# EAGLE design beacon (EAGLE 6.4)
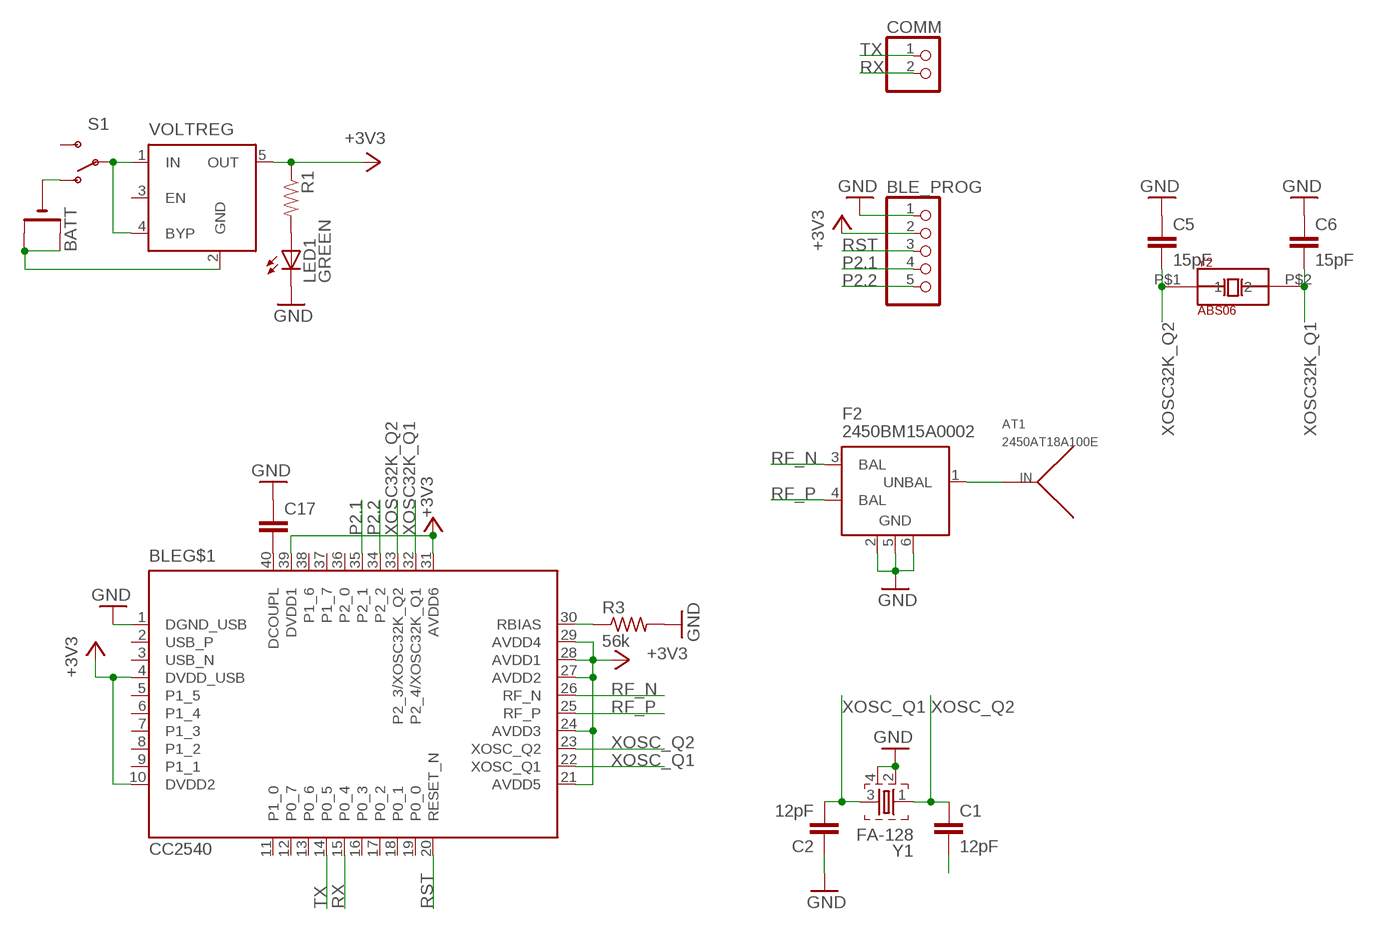
[diagram p0: schematic, sheet 1]

## Parts
AT1  2450AT18A100E  [2450AT18A100E]
BATT  CR2032SMT  [CR2032-SMD]
BLE  CC2540  [QFN40-6X6]
BLE_PROG  PINHD-1X5  [1X05]
C1  12pF  C-EUC0402  [C0402]
C2  12pF  C-EUC0402  [C0402]
C5  15pF  C-EUC0402  [C0402]
C6  15pF  C-EUC0402  [C0402]
C17  C-EUC0402  [C0402]
COMM  PINHD-1X2  [1X02]
F2  2450BM15A0002  [2450BM15A0002]
LED1  GREEN  LED-GREEN0603  [LED-0603]
R1  RESISTOR0402-RES  [0402-RES]
R3  56k  R-US_R0402  [R0402]
S1  SWITCH-SPDT-SMD-A  [SWITCH-SPST-SMD-A]
VOLTREG  MIC5219XX  [SOT23-5]
Y1  FA-128  [FA-128]
Y2  ABS06  [SMD]

## Nets
+3V3: BLE.4(DVDD_USB) BLE.10(DVDD2) BLE.21(AVDD5) BLE.24(AVDD3) BLE.27(AVDD2) BLE.28(AVDD1) BLE.29(AVDD4) BLE.31(AVDD6) BLE.39(DVDD1) BLE_PROG.2 R1.1 VOLTREG.5(OUT)
GND: BLE.1(DGND_USB) BLE_PROG.1 C2.1 C5.1 C6.1 C17.1 F2.2(GND) F2.5(GND) F2.6(GND) LED1.C R3.2 Y1.2 Y1.4
N$1: BLE.40(DCOUPL) C17.2
N$2: BLE.30(RBIAS) R3.1
N$3: LED1.A R1.2
N$4: AT1.P$1(IN) F2.1(UNBAL)
N$5: BATT.- S1.1(O)
N$6: S1.2(P) VOLTREG.1(IN) VOLTREG.4(BYP)
N$7: BATT.+$1(+) BATT.+$2(+1) VOLTREG.2(GND)
N$8: C1.2
P2.1: BLE.35(P2_1) BLE_PROG.4
P2.2: BLE.34(P2_2) BLE_PROG.5
RF_N: BLE.26(RF_N) F2.3(BAL)
RF_P: BLE.25(RF_P) F2.4(BAL)
RST: BLE.20(RESET_N) BLE_PROG.3
RX: BLE.15(P0_4) COMM.2
TX: BLE.14(P0_5) COMM.1
XOSC32K_Q1: BLE.32(P2_4/XOSC32K_Q1) C6.2 Y2.P$2
XOSC32K_Q2: BLE.33(P2_3/XOSC32K_Q2) C5.2 Y2.P$1
XOSC_Q1: BLE.22(XOSC_Q1) C2.2 Y1.3
XOSC_Q2: BLE.23(XOSC_Q2) C1.1 Y1.1
Unconnected: BLE.2(USB_P) BLE.3(USB_N) BLE.5(P1_5) BLE.6(P1_4) BLE.7(P1_3) BLE.8(P1_2) BLE.9(P1_1) BLE.11(P1_0) BLE.12(P0_7) BLE.13(P0_6) BLE.16(P0_3) BLE.17(P0_2) BLE.18(P0_1) BLE.19(P0_0) BLE.36(P2_0) BLE.37(P1_7) BLE.38(P1_6) BLE.EXP@1(EXP:EXP16) BLE.EXP@2(EXP:EXP16) BLE.EXP@3(EXP:EXP16) BLE.EXP@4(EXP:EXP16) BLE.EXP@5(EXP:EXP16) BLE.EXP@6(EXP:EXP16) BLE.EXP@7(EXP:EXP16) BLE.EXP@8(EXP:EXP16) BLE.EXP@9(EXP:EXP16) BLE.EXP@10(EXP:EXP16) BLE.EXP@11(EXP:EXP16) BLE.EXP@12(EXP:EXP16) BLE.EXP@13(EXP:EXP16) BLE.EXP@14(EXP:EXP16) BLE.EXP@15(EXP:EXP16) BLE.EXP@16(EXP:EXP16) S1.3(S) VOLTREG.3(EN)

## Library data of the parts
AT1 = ble-arduino:2450AT18A100E
BATT = adafruit:CR2032
BLE = texas:CC2540: 2.4-GHz Bluetooth® low energy System-on-Chip Auto generated by make-symbol-device-package-bsdl.ulp Rev. 39 Source: cc2540.txt
BLE_PROG = pinhead:PINHD-1X5: PIN HEADER
C1 C2 C5 C6 C17 = rcl:C-EU: CAPACITOR, European symbol
COMM = pinhead:PINHD-1X2: PIN HEADER
F2 = johanson-technology:2450BM15A0002: 2.45 GHz Impedance Matched Balun-Filter For TI CC253X/CC2540 Chipset family Data sheet <http://www.johansontechnology.com/images/stories/ip/baluns/balun_filter_combo_matched_2450bm15a0002_v8.pdf>
LED1 = SparkFun-LED:LED-GREEN: Various green LEDs 0603- DIO-00821 LARGE- DIO-00862 LILYPAD- DIO-09910; PROD_ID: DIO-00821
R1 = SparkFun-Passives:RESISTOR: Resistor Basic schematic elements and footprints for 0603, 1206, and PTH resistors.
R3 = resistor:R-US_: RESISTOR, American symbol
S1 = SparkFun-Electromechanical:SWITCH-SPDT: SPDT Switch Simple slide switch, Spark Fun Electronics SKU : COM-00102 DPDT SMT slide switch, AYZ0202, SWCH-08179
VOLTREG = v-reg-micrel:MIC5219XX: VOLTAGE REGULATOR; OC_FARNELL: unknown; OC_NEWARK: unknown
Y1 = crystal:FA-: MHz RANGE CRYSTAL UNIT Source: Epson Toyocom
Y2 = abracon:ABS06

## Net classes
0 default: width 0.203 mm

## Board
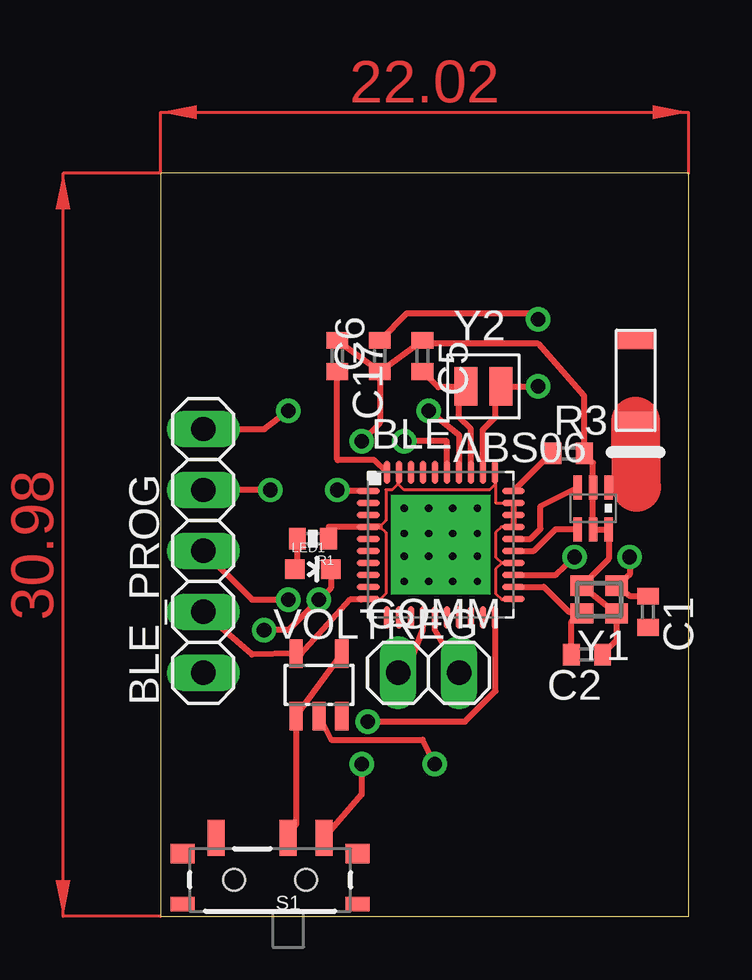
[diagram p1: board, top side]
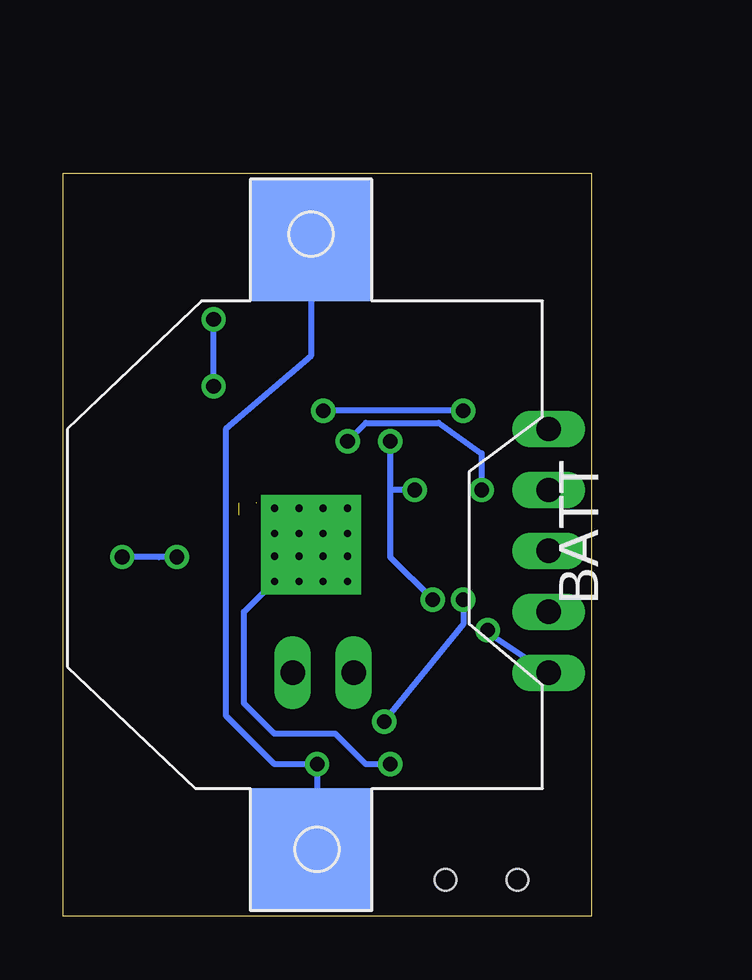
[diagram p2: board, bottom side, seen from below]

Size 22.02 x 30.98 mm. Coordinates in mm from the lower left corner, seen from the top.
Outline: 0,0 22.02,0 22.02,30.98 0,30.98 0,0
Copper layers (1*16): Top 0.035mm / dielectric 1.5mm / Bottom 0.035mm
Design rules "default": minimum track width 10mil, minimum drill 24mil, track to track 8mil, track to pad 8mil, pad to pad 8mil, via to via 8mil, smd to smd 8mil, copper to edge 40mil, drill to drill 8mil, minimum pad ring 10mil, minimum via ring 8mil, stop-mask expansion 4mil, vias tented up to drill 0mil, thermal gap 10mil

### Footprints (pad centres in the part's own frame; a part is rotated, then mirrored left to right if it is on the bottom)
2450AT18A100E = smd 0.8 x 1.6: P$1 1.7,0; P$2 -1.7,0
CR2032-SMD = smd 5.08 x 5.08: +$1 -12.7,0; +$2 12.7,0 | smd 4.064 x 4.064: - 0,0
QFN40-6X6 = smd 0.95 x 0.28: 1 -3.025,2.25; 2 -3.025,1.75; 3 -3.025,1.25; 4 -3.025,0.75; 5 -3.025,0.25; 6 -3.025,-0.25; 7 -3.025,-0.75; 8 -3.025,-1.25; 9 -3.025,-1.75; 10 -3.025,-2.25; 21 3.025,-2.25; 22 3.025,-1.75; 23 3.025,-1.25; 24 3.025,-0.75; 25 3.025,-0.25; 26 3.025,0.25; 27 3.025,0.75; 28 3.025,1.25; 29 3.025,1.75; 30 3.025,2.25 | smd 0.28 x 0.95: 11 -2.25,-3.025; 12 -1.75,-3.025; 13 -1.25,-3.025; 14 -0.75,-3.025; 15 -0.25,-3.025; 16 0.25,-3.025; 17 0.75,-3.025; 18 1.25,-3.025; 19 1.75,-3.025; 20 2.25,-3.025; 31 2.25,3.025; 32 1.75,3.025; 33 1.25,3.025; 34 0.75,3.025; 35 0.25,3.025; 36 -0.25,3.025; 37 -0.75,3.025; 38 -1.25,3.025; 39 -1.75,3.025; 40 -2.25,3.025 | drill 0.3 pad 1.1 square: EXP@1 -1.525,1.525; EXP@2 -0.5,1.525; EXP@3 0.5,1.525; EXP@4 1.525,1.525; EXP@5 -1.525,0.475; EXP@6 -0.5,0.475; EXP@7 0.5,0.475; EXP@8 1.525,0.475; EXP@9 -1.525,-0.475; EXP@10 -0.5,-0.475; EXP@11 0.5,-0.475; EXP@12 1.525,-0.475; EXP@13 -1.525,-1.525; EXP@14 -0.5,-1.525; EXP@15 0.5,-1.525; EXP@16 1.525,-1.525
1X05 = drill 1.016 long: 1 -5.08,0; 2 -2.54,0; 3 0,0; 4 2.54,0; 5 5.08,0
C0402 = smd 0.7 x 0.9: 1 -0.65,0; 2 0.65,0
1X02 = drill 1.016 long: 1 -1.27,0; 2 1.27,0
2450BM15A0002 = smd 0.35 x 1: 1 -0.65,-0.875; 2 0,-0.875; 3 0.65,-0.875; 4 0.65,0.875; 5 0,0.875; 6 -0.65,0.875
LED-0603 = smd 0.8 x 0.8: A 0,-0.75; C 0,0.75
0402-RES = smd 0.7 x 0.9: 1 -0.65,0; 2 0.65,0
R0402 = smd 0.7 x 0.9: 1 -0.65,0; 2 0.65,0
SWITCH-SPST-SMD-A = smd 0.7 x 1.5: 1 -2.25,-1.75; 2 -0.75,-1.75; 3 2.25,-1.75 | smd 1 x 0.6: GND1 -3.65,1; GND3 3.65,1 | smd 1 x 0.8: GND2 -3.65,-1.1; GND4 3.65,-1.1 | hole 0.9: -1.5,0; 1.5,0
SOT23-5 = smd 0.55 x 1.2: 1 -0.95,-1.3; 2 0,-1.3; 3 0.95,-1.3; 4 0.95,1.3; 5 -0.95,1.3
FA-128 = smd 0.95 x 0.85: 1 -0.725,-0.575; 2 0.725,-0.575; 3 0.725,0.575; 4 -0.725,0.575
SMD = smd 0.95 x 1.6: P$1 -0.725,0; P$2 0.725,0

### Placement (x,y rotation side)
AT1  19.81,22.35 270 top
BATT  11.68,15.49 270 bottom
BLE  11.68,15.49 0 top
BLE_PROG  1.78,15.24 90 top
C1  20.32,12.7 270 top
C2  17.78,10.92 180 top
C5  10.92,23.37 270 top
C6  9.14,23.37 90 top
C17  7.37,23.37 270 top
COMM  11.18,10.16 0 top
F2  18.03,17.02 180 top
LED1  6.35,14.48 270 top
R1  6.35,15.75 180 top
R3  17.02,19.3 0 top
S1  4.57,1.52 180 top
VOLTREG  6.6,9.65 0 top
Y1  18.29,13.21 180 top
Y2  13.46,22.1 0 top

### Tracks (layer width: path | path; a pad name or v marks a point on that pad's centre or on a via)
+3V3  (2 unrouted)
  Top 0.122: 9.16,16.24 9.4,16
  Top 0.127: 13.97,18.52 13.97,18.03 13.97,17.25 | 13.97,17.24 BLE.29 | BLE.27 14.21,16.24 13.97,16 13.97,14.99 14.22,14.73 BLE.24 | BLE.24 14.24,14.74 13.97,14.48 13.97,13.46 14.22,13.21 14.67,13.21 | BLE.31 13.93,18 13.72,17.78 10.16,17.78 9.91,18.03 9.91,18.49 | BLE.39 9.93,18.06 9.65,17.78 9.4,17.78 9.4,16.51 9.14,16.26 | BLE.4 9.16,16.24 | 9.4,16 9.4,13.46 9.14,13.21 8.7,13.21
  Top 0.254: BLE.31 13.97,18.52 | BLE.29 BLE.27 | BLE.24 | 14.67,13.21 BLE.21 | 9.91,18.49 BLE.39 | 9.14,16.26 8.67,16.26 BLE.4 7.01,16.24 R1.1 | 8.7,13.21 BLE.10 8.37,13.21 7.91,13.21 5.84,10.92 VOLTREG.5 5.6,10.96 5.62,10.96 3.81,10.92 BLE_PROG.2
GND  (via drill 0.61)
  Top 0.254: C6.1 C5.1 11.29,23.88 15.75,23.88 17.67,21.7 R3.2 18.03,18.91 F2.2 F2.5 F2.6 18.68,14.9 Y1.2 Y1.4 19.01,11.51 C2.1 | C6.1 C17.1 | C6.1 9.14,20.57 v8.38,19.81 | v4.32,11.94 5.33,11.94 v6.6,13.21 7.1,13.7 LED1.C | BLE.1 7.4,17.74 v7.37,17.78
  Bottom 0.254: v8.38,19.81 8.38,17.78 | 8.38,17.78 8.38,14.99 v6.6,13.21 | v4.32,11.94 4.06,11.68 BLE_PROG.1 | v7.37,17.78 8.38,17.78
N$1
  Top 0.254: BLE.40 8.91,19.03 7.39,19.03 7.37,19.05 C17.2
N$2
  Top 0.254: R3.1 16.27,19.3 BLE.30
N$3
  Top 0.254: R1.2 5.7,14.58 LED1.A
N$4
  Top 0.254: F2.1 19.85,17.89
  Top 2.032: 19.85,17.89 AT1.P$1
N$5  (via drill 0.61)
  Top 0.254: v8.38,6.35 8.38,5.09 S1.1
  Bottom 0.254: v8.38,6.35 9.4,6.35 10.67,7.62 13.21,7.62 14.48,8.89 14.48,12.7 BATT.-
N$6
  Top 0.254: VOLTREG.4 VOLTREG.1 5.65,3.86 S1.2
N$7  (via drill 0.6)
  Top 0.254: VOLTREG.2 7.11,7.37 10.92,7.37 v11.43,6.35
  Bottom 0.254: BATT.+$2 11.43,3.3 v11.43,6.35 13.21,6.35 15.24,8.38 15.24,20.32 11.68,23.37 BATT.+$1
P2.1  (via drill 0.61)
  Top 0.254: BLE.35 11.94,19.81 v10.16,19.81 | v4.57,17.78 BLE_PROG.4
  Bottom 0.254: v10.16,19.81 9.4,20.57 6.35,20.57 4.57,19.3 v4.57,17.78
P2.2  (via drill 0.61)
  Top 0.254: BLE_PROG.5 4.32,20.32 v5.33,21.08 | BLE.34 12.45,18.53 12.45,20.07 v11.18,21.08
  Bottom 0.254: v5.33,21.08 10.92,21.08 v11.18,21.08
RF_N
  Top 0.254: BLE.26 15.42,15.74 15.84,16.16 15.84,17.11 F2.3
RF_P
  Top 0.254: BLE.25 15.57,15.24 16.16,15.84 16.47,16.14 F2.4
RST  (via drill 0.61)
  Top 0.254: BLE_PROG.3 3.81,13.21 v5.33,13.21 | v8.64,8.13 12.7,8.13 13.97,9.4 13.97,12.43 BLE.20
  Bottom 0.254: v5.33,13.21 5.33,12.19 v8.64,8.13
RX
  Top 0.254: BLE.15 11.43,11.96 COMM.2
TX
  Top 0.254: BLE.14 10.92,12.2 10.92,11.94 10.41,10.67 COMM.1
XOSC32K_Q1  (via drill 0.61)
  Top 0.254: BLE.32 13.43,20.29 13.97,20.83 13.97,22.06 Y2.P$2 14.99,22.1 v15.75,22.1 | C6.2 10.27,25.15 15.49,25.15 v15.75,24.89
  Bottom 0.254: v15.75,22.1 15.75,24.64 v15.75,24.89
XOSC32K_Q2
  Top 0.254: BLE.33 12.93,20.34 12.45,20.83 12.45,22.06 | 12.45,22.06 Y2.P$1 | 12.45,22.06 11.58,22.06 C5.2
XOSC_Q1
  Top 0.254: C2.2 17.13,12.3 Y1.3 17.5,12.7 17.02,12.7 15.97,13.74 BLE.22
XOSC_Q2  (via drill 0.61)
  Top 0.254: C1.1 19.6,13.35 Y1.1 19.56,14.25 v19.56,14.99 | BLE.23 16.49,14.24 v17.27,14.99
  Bottom 0.254: v17.27,14.99 18.03,14.99 v19.56,14.99
(copper drawn outside any net)
  shapes: Top area x2